# Altium project PCB_Project.PrjPcb
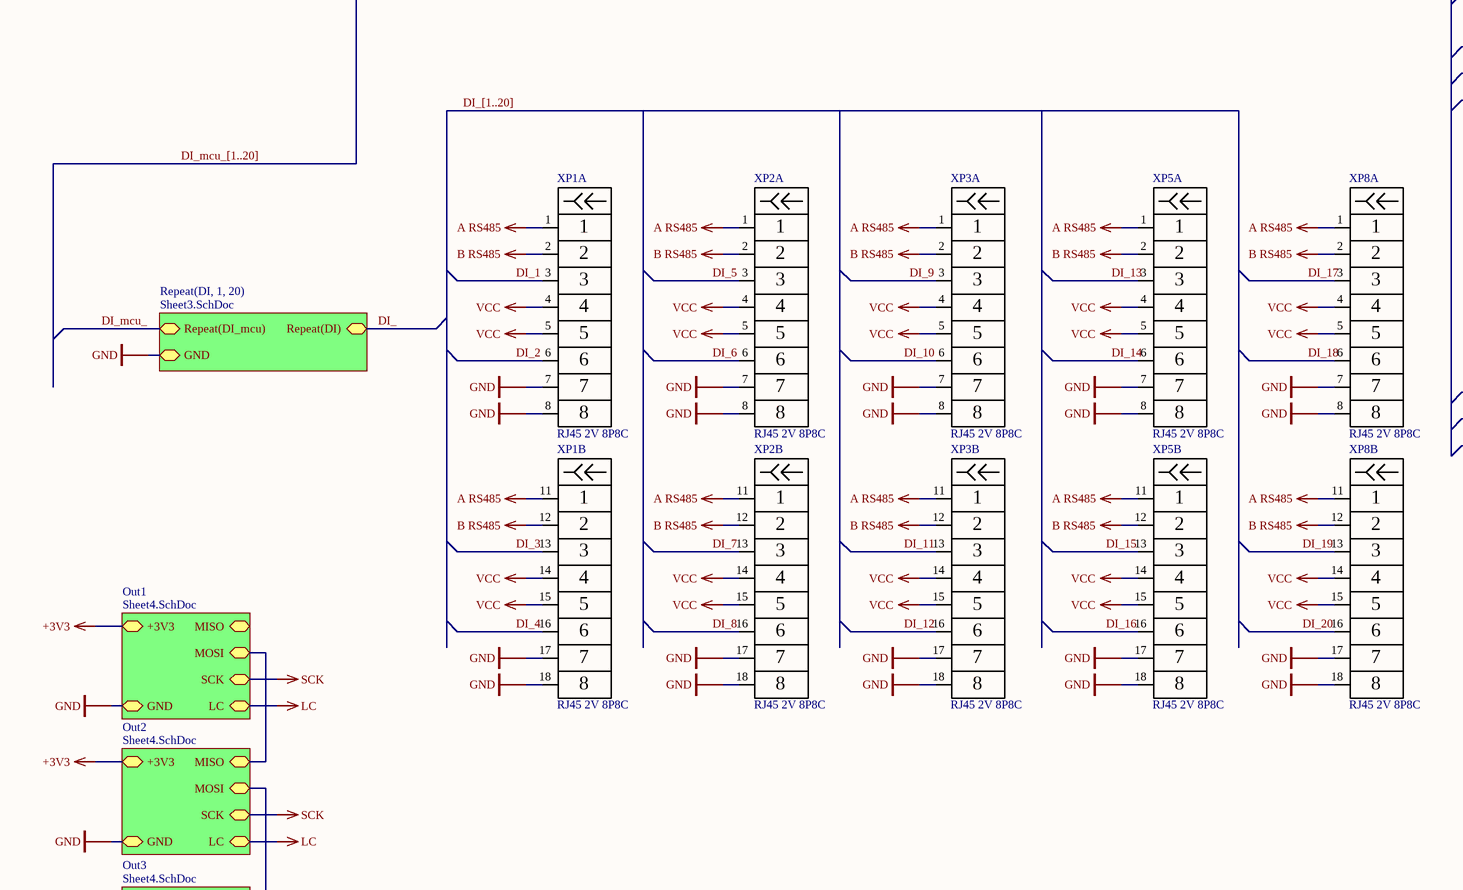
[diagram p0: Sheet1.SchDoc, top left]
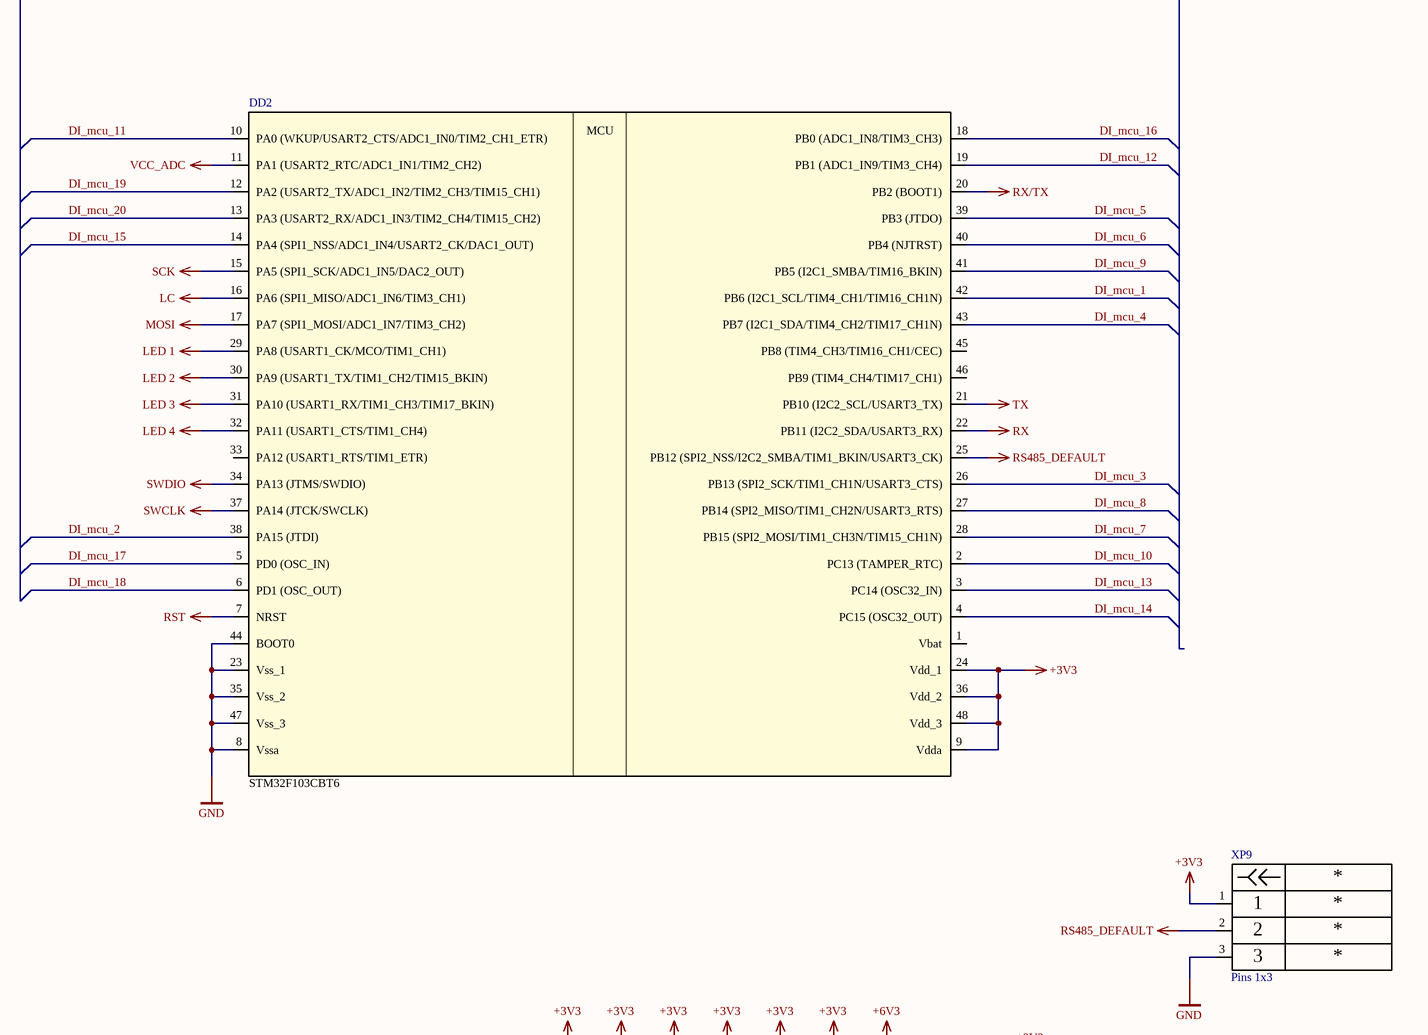
[diagram p1: Sheet1.SchDoc, top right]
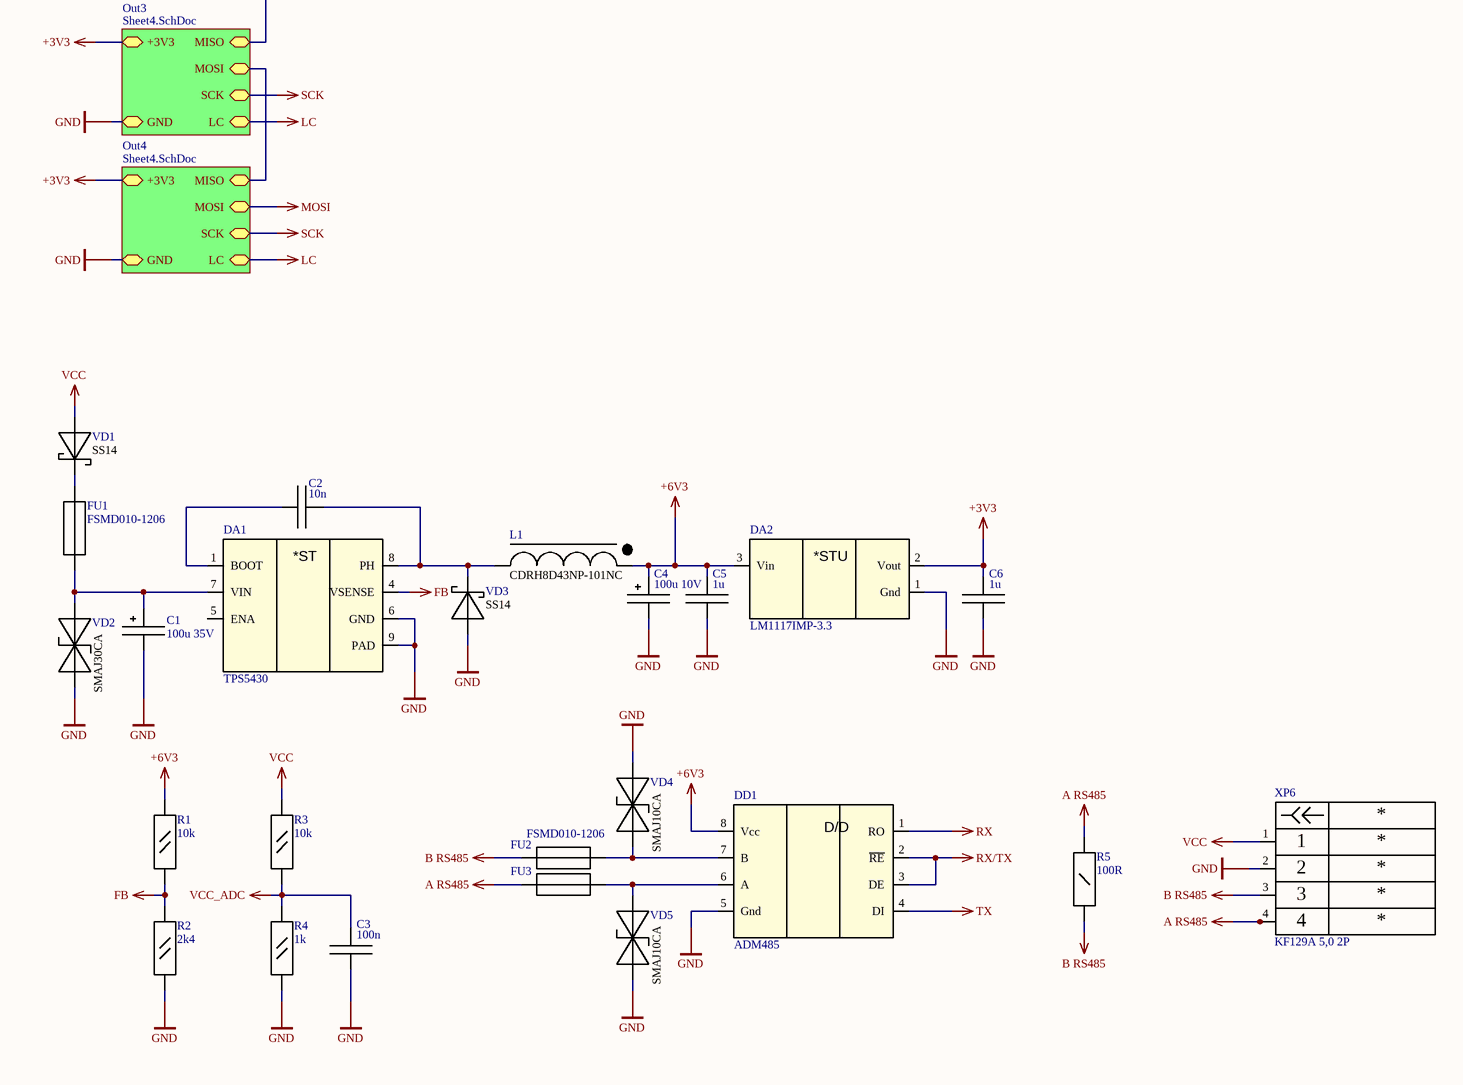
[diagram p2: Sheet1.SchDoc, bottom left]
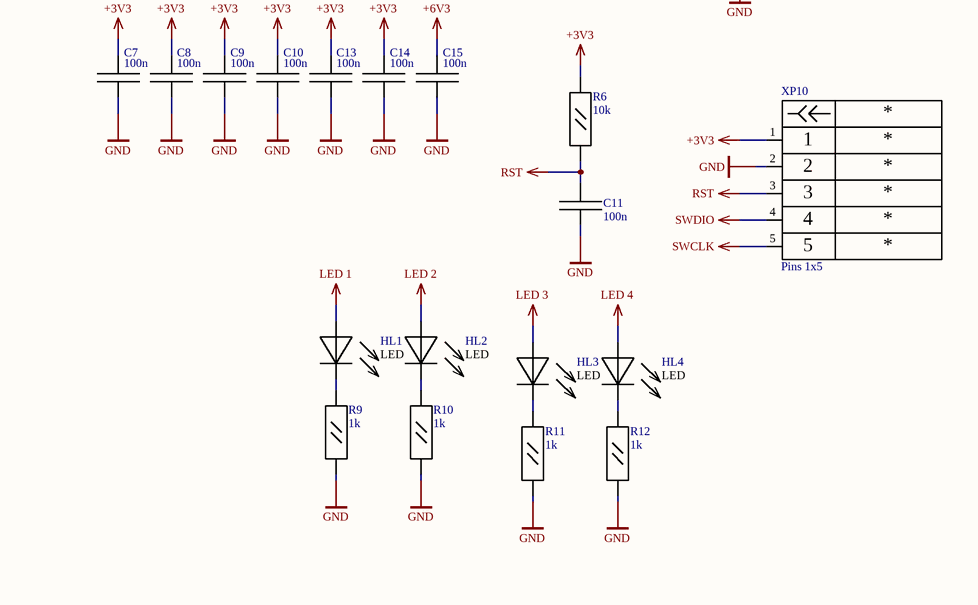
[diagram p3: Sheet1.SchDoc, bottom right]
3 sheets, 201 parts. Net scope: hierarchical (ports join the sheet entries above them; power ports are global).
Board file: PCB3.PcbDoc
Sheets:
  Sheet1.SchDoc
    Out1 = Sheet4.SchDoc
    Out2 = Sheet4.SchDoc
    Out3 = Sheet4.SchDoc
    Out4 = Sheet4.SchDoc
    DI1 = Sheet3.SchDoc
    DI2 = Sheet3.SchDoc
    DI3 = Sheet3.SchDoc
    DI4 = Sheet3.SchDoc
    DI5 = Sheet3.SchDoc
    DI6 = Sheet3.SchDoc
    DI7 = Sheet3.SchDoc
    DI8 = Sheet3.SchDoc
    DI9 = Sheet3.SchDoc
    DI10 = Sheet3.SchDoc
    DI11 = Sheet3.SchDoc
    DI12 = Sheet3.SchDoc
    DI13 = Sheet3.SchDoc
    DI14 = Sheet3.SchDoc
    DI15 = Sheet3.SchDoc
    DI16 = Sheet3.SchDoc
    DI17 = Sheet3.SchDoc
    DI18 = Sheet3.SchDoc
    DI19 = Sheet3.SchDoc
    DI20 = Sheet3.SchDoc

## Sheet Sheet1.SchDoc
size 594 x 420 mm; Razrabotal: {Разработал}; Prov: {Проверил}; Tkont: {Т. конт.}; Nkont: {Н. конт.}; Utv: {Утвердил}; Naimenovanie: {Наименование}; Oboznachenie: {Обозначение}; Shifr: {Шифр}

### Parts
C1  100u 35V  [Cap electro d6.3x2.54mm]
C2  10n  [Cap Ceramic 0805]
C3  100n  [Cap Ceramic 0805]
C4  100u 10V  [Cap electro d6.3x2.54mm]
C5  1u  [Cap Ceramic 0805]
C6  1u  [Cap Ceramic 0805]
C7  100n  [Cap Ceramic 0805]
C8  100n  [Cap Ceramic 0805]
C9  100n  [Cap Ceramic 0805]
C10  100n  [Cap Ceramic 0805]
C11  100n  [Cap Ceramic 0805]
C13  100n  [Cap Ceramic 0805]
C14  100n  [Cap Ceramic 0805]
C15  100n  [Cap Ceramic 0805]
DA1  TPS5430  [SO8 S1.27W6.00 GP]
DA2  LM1117IMP-3.3  [SOT-232]
DD1  ADM485  [SO8 S1.27W6.00]
DD2  STM32F103CBT6  [TQFP48 S0.5]
FU1  FSMD010-1206  [Fuse 1206]
FU2  FSMD010-1206  [Fuse 1206]
FU3  FSMD010-1206  [Fuse 1206]  (value not drawn)
HL1  LED  [LED 0805]
HL2  LED  [LED 0805]
HL3  LED  [LED 0805]
HL4  LED  [LED 0805]
L1  CDRH8D43NP-101NC  [CDRH8D43NP-xxxNC]
R1  10k  [Resistor 0805]
R2  2k4  [Resistor 0805]
R3  10k  [Resistor 0805]
R4  1k  [Resistor 0805]
R5  100R  [Resistor 1206]
R6  10k  [Resistor 0805]
R9  1k  [Resistor 0805]
R10  1k  [Resistor 0805]
R11  1k  [Resistor 0805]
R12  1k  [Resistor 0805]
VD1  SS14  [DO-214AC SMA]
VD2  SMAJ30CA  [DO-214AC SMA]
VD3  SS14  [DO-214AC SMA]
VD4  SMAJ10CA  [DO-214AC SMA]
VD5  SMAJ10CA  [DO-214AC SMA]
XP1  RJ45 2V 8P8C  [RJ45 2V 8P8C]  (parts A,B of 2)
XP2  RJ45 2V 8P8C  [RJ45 2V 8P8C]  (parts A,B of 2)
XP3  RJ45 2V 8P8C  [RJ45 2V 8P8C]  (parts A,B of 2)
XP5  RJ45 2V 8P8C  [RJ45 2V 8P8C]  (parts A,B of 2)
XP6  KF129A 5,0 2P  [KF129A 5,0 2P]
XP8  RJ45 2V 8P8C  [RJ45 2V 8P8C]  (parts A,B of 2)
XP9  Pins 1x3  [Pins 1x3]
XP10  Pins 1x5  [Pins 1x5]

### Sub-sheets
Out1 = Sheet4.SchDoc: +3V3, GND, LC, MISO, MOSI, SCK
Out2 = Sheet4.SchDoc: +3V3, GND, LC, MISO, MOSI, SCK
Out3 = Sheet4.SchDoc: +3V3, GND, LC, MISO, MOSI, SCK
Out4 = Sheet4.SchDoc: +3V3, GND, LC, MISO, MOSI, SCK
Repeat(DI, 1, 20) = Sheet3.SchDoc: GND, Repeat(DI), Repeat(DI_mcu)

### Nets
+3V3: C6.2 C7.2 C8.2 C9.2 C10.2 C13.2 C14.2 DA2.2(Vout) DD2.9(Vdda) DD2.24(Vdd_1) DD2.36(Vdd_2) DD2.48(Vdd_3) R6.1 XP9.1 XP10.1 ; sheet Out1/+3V3, sheet Out2/+3V3, sheet Out3/+3V3, sheet Out4/+3V3
+6V3: C4.2 C5.2 C15.2 DA2.3(Vin) DD1.8(Vcc) L1.1 R1.1
A RS485: FU3.1 R5.1 XP1.1 XP1.11 XP2.1 XP2.11 XP3.1 XP3.11 XP5.1 XP5.11 XP6.4 XP8.1 XP8.11
B RS485: FU2.1 R5.2 XP1.2 XP1.12 XP2.2 XP2.12 XP3.2 XP3.12 XP5.2 XP5.12 XP6.3 XP8.2 XP8.12
FB: DA1.4(VSENSE) R1.2 R2.1
GND: C1.1 C3.1 C4.1 C5.1 C6.1 C7.1 C8.1 C9.1 C10.1 C11.1 C13.1 C14.1 C15.1 DA1.6(GND) DA1.9(PAD) DA2.1(Gnd) DD1.5(Gnd) DD2.8(Vssa) DD2.23(Vss_1) DD2.35(Vss_2) DD2.44(BOOT0) DD2.47(Vss_3) R2.2 R4.2 R9.2 R10.2 R11.2 R12.2 VD2.1 VD3.1(A) VD4.1 VD5.1 XP1.7 XP1.8 XP1.17 XP1.18 XP2.7 XP2.8 XP2.17 XP2.18 XP3.7 XP3.8 XP3.17 XP3.18 XP5.7 XP5.8 XP5.17 XP5.18 XP6.2 XP8.7 XP8.8 XP8.17 XP8.18 XP9.3 XP10.2 ; sheet Out1/GND, sheet Out2/GND, sheet Out3/GND, sheet Out4/GND, sheet Repeat(DI, 1, 20)/GND
LC: DD2.16(PA6_(SPI1_MISO/ADC1_IN6/TIM3_CH1)) ; sheet Out1/LC, sheet Out2/LC, sheet Out3/LC, sheet Out4/LC
LED 1: DD2.29(PA8_(USART1_CK/MCO/TIM1_CH1)) HL1.1(A)
LED 2: DD2.30(PA9_(USART1_TX/TIM1_CH2/TIM15_BKIN)) HL2.1(A)
LED 3: DD2.31(PA10_(USART1_RX/TIM1_CH3/TIM17_BKIN)) HL3.1(A)
LED 4: DD2.32(PA11_(USART1_CTS/TIM1_CH4)) HL4.1(A)
MOSI: DD2.17(PA7_(SPI1_MOSI/ADC1_IN7/TIM3_CH2)) ; sheet Out4/MOSI
RS485_DEFAULT: DD2.25(PB12_(SPI2_NSS/I2C2_SMBA/TIM1_BKIN/USART3_CK)) XP9.2
RST: C11.2 DD2.7(NRST) R6.2 XP10.3
RX: DD1.1(RO) DD2.22(PB11_(I2C2_SDA/USART3_RX))
RX/TX: DD1.2(~{RE}) DD1.3(DE) DD2.20(PB2_(BOOT1))
SCK: DD2.15(PA5_(SPI1_SCK/ADC1_IN5/DAC2_OUT)) ; sheet Out1/SCK, sheet Out2/SCK, sheet Out3/SCK, sheet Out4/SCK
SWCLK: DD2.37(PA14_(JTCK/SWCLK)) XP10.5
SWDIO: DD2.34(PA13_(JTMS/SWDIO)) XP10.4
TX: DD1.4(DI) DD2.21(PB10_(I2C2_SCL/USART3_TX))
VCC: R3.1 VD1.1(A) XP1.4 XP1.5 XP1.14 XP1.15 XP2.4 XP2.5 XP2.14 XP2.15 XP3.4 XP3.5 XP3.14 XP3.15 XP5.4 XP5.5 XP5.14 XP5.15 XP6.1 XP8.4 XP8.5 XP8.14 XP8.15
VCC_ADC: C3.2 DD2.11(PA1_(USART2_RTC/ADC1_IN1/TIM2_CH2)) R3.2 R4.1
DI_: sheet Repeat(DI, 1, 20)/Repeat(DI)
DI_1: XP1.3
DI_2: XP1.6
DI_3: XP1.13
DI_4: XP1.16
DI_5: XP2.3
DI_6: XP2.6
DI_7: XP2.13
DI_8: XP2.16
DI_9: XP3.3
DI_10: XP3.6
DI_11: XP3.13
DI_12: XP3.16
DI_13: XP5.3
DI_14: XP5.6
DI_15: XP5.13
DI_16: XP5.16
DI_17: XP8.3
DI_18: XP8.6
DI_19: XP8.13
DI_20: XP8.16
DI_mcu_: sheet Repeat(DI, 1, 20)/Repeat(DI_mcu)
DI_mcu_1: DD2.42(PB6_(I2C1_SCL/TIM4_CH1/TIM16_CH1N))
DI_mcu_2: DD2.38(PA15_(JTDI))
DI_mcu_3: DD2.26(PB13_(SPI2_SCK/TIM1_CH1N/USART3_CTS))
DI_mcu_4: DD2.43(PB7_(I2C1_SDA/TIM4_CH2/TIM17_CH1N))
DI_mcu_5: DD2.39(PB3_(JTDO))
DI_mcu_6: DD2.40(PB4_(NJTRST))
DI_mcu_7: DD2.28(PB15_(SPI2_MOSI/TIM1_CH3N/TIM15_CH1N))
DI_mcu_8: DD2.27(PB14_(SPI2_MISO/TIM1_CH2N/USART3_RTS))
DI_mcu_9: DD2.41(PB5_(I2C1_SMBA/TIM16_BKIN))
DI_mcu_10: DD2.2(PC13_(TAMPER_RTC))
DI_mcu_11: DD2.10(PA0_(WKUP/USART2_CTS/ADC1_IN0/TIM2_CH1_ETR))
DI_mcu_12: DD2.19(PB1_(ADC1_IN9/TIM3_CH4))
DI_mcu_13: DD2.3(PC14_(OSC32_IN))
DI_mcu_14: DD2.4(PC15_(OSC32_OUT))
DI_mcu_15: DD2.14(PA4_(SPI1_NSS/ADC1_IN4/USART2_CK/DAC1_OUT))
DI_mcu_16: DD2.18(PB0_(ADC1_IN8/TIM3_CH3))
DI_mcu_17: DD2.5(PD0_(OSC_IN))
DI_mcu_18: DD2.6(PD1_(OSC_OUT))
DI_mcu_19: DD2.12(PA2_(USART2_TX/ADC1_IN2/TIM2_CH3/TIM15_CH1))
DI_mcu_20: DD2.13(PA3_(USART2_RX/ADC1_IN3/TIM2_CH4/TIM15_CH2))
NetC1_2: C1.2 DA1.7(VIN) FU1.2 VD2.2
NetC2_1: C2.1 DA1.1(BOOT)
NetC2_2: C2.2 DA1.8(PH) L1.2 VD3.2(K)
NetDD1_6: DD1.6(A) FU3.2 VD5.2
NetDD1_7: DD1.7(B) FU2.2 VD4.2
NetDD4_Out1_14: sheet Out1/MOSI, sheet Out2/MISO
NetDD4_Out2_14: sheet Out2/MOSI, sheet Out3/MISO
NetDD4_Out3_14: sheet Out3/MOSI, sheet Out4/MISO
NetFU1_1: FU1.1 VD1.2(K)
NetHL1_2: HL1.2(K) R9.1
NetHL2_2: HL2.2(K) R10.1
NetHL3_2: HL3.2(K) R11.1
NetHL4_2: HL4.2(K) R12.1

Not connected (* = marked no-connect by the designer): DA1 2(NC) 3(NC) 5(ENA); DD2 1(Vbat) 33(PA12_(USART1_RTS/TIM1_ETR)) 45(PB8_(TIM4_CH3/TIM16_CH1/CEC)) 46(PB9_(TIM4_CH4/TIM17_CH1))

### Buses and harness runs
bus DI_[1..20]
bus DI_mcu_[1..20]

### Notes on the sheet
- Перв. примен.
- Спра. №
- Подп. и дата
- Инв. № бубл.
- Взам. инв. №
- Инв. № подл.
- Лист
- Изм
- № докум.
- Подпись
- Дата
- Копировал
- Формат А2
- (in symbol ADM485) D/D
- (in symbol LM1117IMP-x.x) *STU
- (in symbol STM32F100C4T6) MCU
- (in symbol TPS5430) *ST

### Library data of the parts
C1 C4 = ECap: Comments: *
C2 C3 C5-C11 C13-C15 = CerCap: Comments: *
DA2 = LM1117IMP-x.x: Comments: *
DD2 = STM32F100C4T6
FU1-FU3 = FSMDxxx-1206: Comments: *
L1 = CDRH8D43NP-xxxNC
R1-R4 R6 R9-R12 = Resistor 0,125W: Comments: *
R5 = Resistor 0,25W: Comments: *
VD2 VD4 VD5 = SMAJxxCA: Comments: *
DA1 = TPS5430: Comments: *
DD1 = ADM485: Comments: *
HL1-HL4 = LED: Comments: *
VD1 VD3 = SS14: Comments: *
XP1-XP3 XP5 XP8 = RJ45 2V 8P8C: Comments: *
XP6 = KF129A 5,0 2P: Comments: *; Name1: *; Name2: *; Name3: *; Name: *; Name4: *
XP9 = Pins 1x3: Comments: *; Name1: *; Name: *; Name2: *; Name3: *
XP10 = Pins 1x5: Comments: *; Name1: *; Name: *; Name2: *; Name3: *; Name4: *; Name5: *

## Sheet Sheet4.SchDoc
size 209 x 297 mm; Razrabotal: {Разработал}; Prov: {Проверил}; Tkont: {Т. конт.}; Nkont: {Н. конт.}; Utv: {Утвердил}; Naimenovanie: {Наименование}; Oboznachenie: {Обозначение}; Shifr: {Шифр}
Used 4 times, as channels Out1, Out2, Out3, Out4. Parts and nets are listed once, with the designators drawn on the sheet.
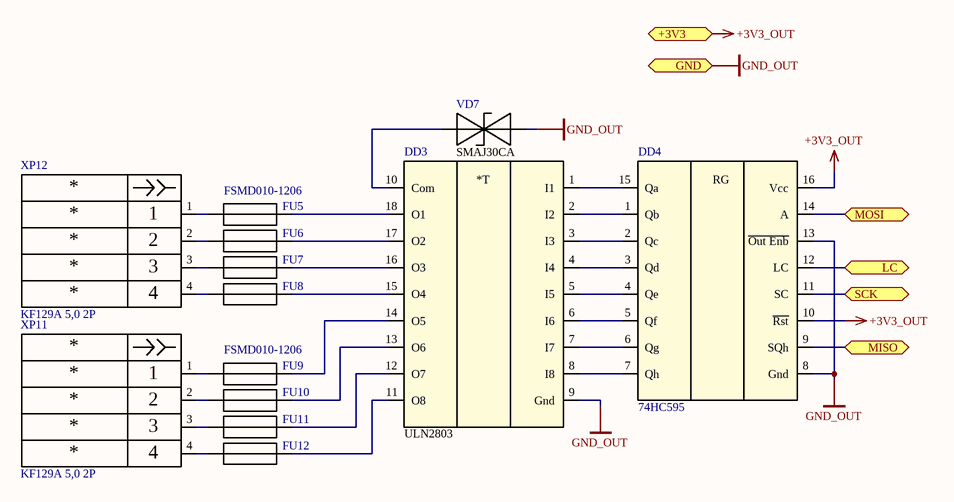
[diagram p4: Sheet4.SchDoc]

### Parts
DD3  ULN2803  [SO18 S1.27W9.9]
DD4  74НС595  [SO16 S1.27W6.00]
FU5  FSMD010-1206  [Fuse 1206]
FU6  FSMDxxx-1206  [Fuse 1206]  (value not drawn)
FU7  FSMDxxx-1206  [Fuse 1206]  (value not drawn)
FU8  FSMDxxx-1206  [Fuse 1206]  (value not drawn)
FU9  FSMD010-1206  [Fuse 1206]
FU10  FSMDxxx-1206  [Fuse 1206]  (value not drawn)
FU11  FSMDxxx-1206  [Fuse 1206]  (value not drawn)
FU12  FSMDxxx-1206  [Fuse 1206]  (value not drawn)
VD7  SMAJ30CA  [DO-214AC SMA]
XP11  KF129A 5,0 2P  [KF129A 5,0 2P]
XP12  KF129A 5,0 2P  [KF129A 5,0 2P]

### Ports
+3V3, GND, LC, MISO, MOSI, SCK

### Nets
+3V3_OUT: DD4.10(~{Rst}) DD4.16(Vcc) ; port +3V3
GND_OUT: DD3.9(Gnd) DD4.8(Gnd) DD4.13(~{Out_Enb}) VD7.1 ; port GND
LC: DD4.12(LC) ; port LC
MISO: DD4.9(SQh) ; port MISO
MOSI: DD4.14(A) ; port MOSI
SCK: DD4.11(SC) ; port SCK
NetDD3_1: DD3.1(I1) DD4.15(Qa)
NetDD3_2: DD3.2(I2) DD4.1(Qb)
NetDD3_3: DD3.3(I3) DD4.2(Qc)
NetDD3_4: DD3.4(I4) DD4.3(Qd)
NetDD3_5: DD3.5(I5) DD4.4(Qe)
NetDD3_6: DD3.6(I6) DD4.5(Qf)
NetDD3_7: DD3.7(I7) DD4.6(Qg)
NetDD3_8: DD3.8(I8) DD4.7(Qh)
NetDD3_10: DD3.10(Com) VD7.2
NetDD3_11: DD3.11(O8) FU12.2
NetDD3_12: DD3.12(O7) FU11.2
NetDD3_13: DD3.13(O6) FU10.2
NetDD3_14: DD3.14(O5) FU9.2
NetDD3_15: DD3.15(O4) FU8.2
NetDD3_16: DD3.16(O3) FU7.2
NetDD3_17: DD3.17(O2) FU6.2
NetDD3_18: DD3.18(O1) FU5.2
NetFU5_1: FU5.1 XP12.1
NetFU6_1: FU6.1 XP12.2
NetFU7_1: FU7.1 XP12.3
NetFU8_1: FU8.1 XP12.4
NetFU9_1: FU9.1 XP11.1
NetFU10_1: FU10.1 XP11.2
NetFU11_1: FU11.1 XP11.3
NetFU12_1: FU12.1 XP11.4

### Channels
Out1: designators end in _Out1; ports +3V3=+3V3 GND=GND LC=LC MISO=NetDD4_Out1_9 MOSI=NetDD4_Out1_14 SCK=SCK
Out2: designators end in _Out2; ports +3V3=+3V3 GND=GND LC=LC MISO=NetDD4_Out1_14 MOSI=NetDD4_Out2_14 SCK=SCK
Out3: designators end in _Out3; ports +3V3=+3V3 GND=GND LC=LC MISO=NetDD4_Out2_14 MOSI=NetDD4_Out3_14 SCK=SCK
Out4: designators end in _Out4; ports +3V3=+3V3 GND=GND LC=LC MISO=NetDD4_Out3_14 MOSI=MOSI SCK=SCK

### Notes on the sheet
- Перв. примен.
- Спра. №
- Подп. и дата
- Инв. № бубл.
- Взам. инв. №
- Инв. № подл.
- Лист
- Изм
- № докум.
- Подпись
- Дата
- Копировал
- Формат А4
- (in symbol 74НС595) RG
- (in symbol ULN2803) *T

### Library data of the parts
FU5 FU9 = FSMDxxx-1206: Comments: *
VD7 = SMAJxxCA: Comments: *
DD4 = 74НС595: Comments: *
FU6-FU8 FU10-FU12 = FSMDxxx-1206: Comments: *
XP11 XP12 = KF129A 5,0 2P: Comments: *; Name1: *; Name2: *; Name3: *; Name: *; Name4: *

## Sheet Sheet3.SchDoc
size 209 x 297 mm; Razrabotal: {Разработал}; Prov: {Проверил}; Tkont: {Т. конт.}; Nkont: {Н. конт.}; Utv: {Утвердил}; Naimenovanie: {Наименование}; Oboznachenie: {Обозначение}; Shifr: {Шифр}
Used 20 times, as channels DI1, DI2, DI3, DI4, DI5, DI6, DI7, DI8, DI9, DI10, DI11, DI12, DI13, DI14, DI15, DI16, DI17, DI18, DI19, DI20. Parts and nets are listed once, with the designators drawn on the sheet.
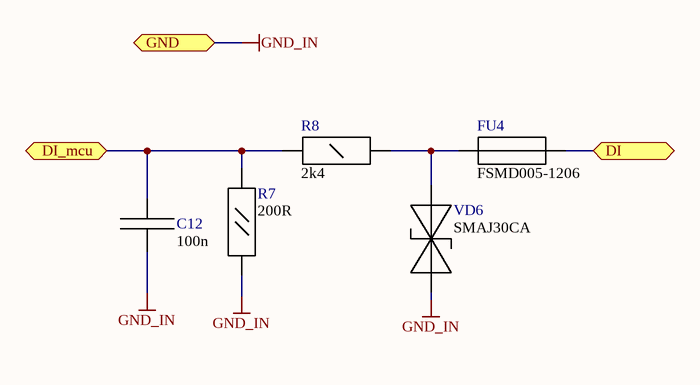
[diagram p5: Sheet3.SchDoc]

### Parts
C12  100n  [Cap Ceramic 0805]
FU4  FSMD005-1206  [Fuse 1206]
R7  200R  [Resistor 0805]
R8  2k4  [Resistor 1206]
VD6  SMAJ30CA  [DO-214AC SMA]

### Ports
DI, DI_mcu, GND

### Nets
GND_IN: C12.2 R7.1 VD6.1 ; port GND
DI: FU4.1 ; port DI
DI_mcu: C12.1 R7.2 R8.1 ; port DI_mcu
NetFU4_2: FU4.2 R8.2 VD6.2

### Channels
DI1: designators end in _DI1; ports DI=DI_1 DI_mcu=DI_mcu_1 GND=GND
DI2: designators end in _DI2; ports DI=DI_2 DI_mcu=DI_mcu_2 GND=GND
DI3: designators end in _DI3; ports DI=DI_3 DI_mcu=DI_mcu_3 GND=GND
DI4: designators end in _DI4; ports DI=DI_4 DI_mcu=DI_mcu_4 GND=GND
DI5: designators end in _DI5; ports DI=DI_5 DI_mcu=DI_mcu_5 GND=GND
DI6: designators end in _DI6; ports DI=DI_6 DI_mcu=DI_mcu_6 GND=GND
DI7: designators end in _DI7; ports DI=DI_7 DI_mcu=DI_mcu_7 GND=GND
DI8: designators end in _DI8; ports DI=DI_8 DI_mcu=DI_mcu_8 GND=GND
DI9: designators end in _DI9; ports DI=DI_9 DI_mcu=DI_mcu_9 GND=GND
DI10: designators end in _DI10; ports DI=DI_10 DI_mcu=DI_mcu_10 GND=GND
DI11: designators end in _DI11; ports DI=DI_11 DI_mcu=DI_mcu_11 GND=GND
DI12: designators end in _DI12; ports DI=DI_12 DI_mcu=DI_mcu_12 GND=GND
DI13: designators end in _DI13; ports DI=DI_13 DI_mcu=DI_mcu_13 GND=GND
DI14: designators end in _DI14; ports DI=DI_14 DI_mcu=DI_mcu_14 GND=GND
DI15: designators end in _DI15; ports DI=DI_15 DI_mcu=DI_mcu_15 GND=GND
DI16: designators end in _DI16; ports DI=DI_16 DI_mcu=DI_mcu_16 GND=GND
DI17: designators end in _DI17; ports DI=DI_17 DI_mcu=DI_mcu_17 GND=GND
DI18: designators end in _DI18; ports DI=DI_18 DI_mcu=DI_mcu_18 GND=GND
DI19: designators end in _DI19; ports DI=DI_19 DI_mcu=DI_mcu_19 GND=GND
DI20: designators end in _DI20; ports DI=DI_20 DI_mcu=DI_mcu_20 GND=GND

### Notes on the sheet
- Перв. примен.
- Спра. №
- Подп. и дата
- Инв. № бубл.
- Взам. инв. №
- Инв. № подл.
- Лист
- Изм
- № докум.
- Подпись
- Дата
- Копировал
- Формат А4

### Library data of the parts
C12 = Capacitor Nonpolar: Comments: *
FU4 = FSMDxxx-1206: Comments: *
R7 = Resistor 0,125W: Comments: *
R8 = Resistor 0,25W: Comments: *
VD6 = SMAJxxCA: Comments: *

## Nets that join several sheets
+3V3: Sheet1 (15 pins), Out1 (DD4_Out1.10 DD4_Out1.16), Out2 (DD4_Out2.10 DD4_Out2.16), Out3 (DD4_Out3.10 DD4_Out3.16), Out4 (DD4_Out4.10 DD4_Out4.16)
GND: Sheet1 (55 pins), Out1 (DD3_Out1.9 DD4_Out1.8 DD4_Out1.13 VD7_Out1.1), Out2 (DD3_Out2.9 DD4_Out2.8 DD4_Out2.13 VD7_Out2.1), Out3 (DD3_Out3.9 DD4_Out3.8 DD4_Out3.13 VD7_Out3.1), Out4 (DD3_Out4.9 DD4_Out4.8 DD4_Out4.13 VD7_Out4.1), DI1 (C12_DI1.2 R7_DI1.1 VD6_DI1.1), DI2 (C12_DI2.2 R7_DI2.1 VD6_DI2.1), DI3 (C12_DI3.2 R7_DI3.1 VD6_DI3.1), DI4 (C12_DI4.2 R7_DI4.1 VD6_DI4.1), DI5 (C12_DI5.2 R7_DI5.1 VD6_DI5.1), DI6 (C12_DI6.2 R7_DI6.1 VD6_DI6.1), DI7 (C12_DI7.2 R7_DI7.1 VD6_DI7.1), DI8 (C12_DI8.2 R7_DI8.1 VD6_DI8.1), DI9 (C12_DI9.2 R7_DI9.1 VD6_DI9.1), DI10 (C12_DI10.2 R7_DI10.1 VD6_DI10.1), DI11 (C12_DI11.2 R7_DI11.1 VD6_DI11.1), DI12 (C12_DI12.2 R7_DI12.1 VD6_DI12.1), DI13 (C12_DI13.2 R7_DI13.1 VD6_DI13.1), DI14 (C12_DI14.2 R7_DI14.1 VD6_DI14.1), DI15 (C12_DI15.2 R7_DI15.1 VD6_DI15.1), DI16 (C12_DI16.2 R7_DI16.1 VD6_DI16.1), DI17 (C12_DI17.2 R7_DI17.1 VD6_DI17.1), DI18 (C12_DI18.2 R7_DI18.1 VD6_DI18.1), DI19 (C12_DI19.2 R7_DI19.1 VD6_DI19.1), DI20 (C12_DI20.2 R7_DI20.1 VD6_DI20.1)
LC: Sheet1 (DD2.16), Out1 (DD4_Out1.12), Out2 (DD4_Out2.12), Out3 (DD4_Out3.12), Out4 (DD4_Out4.12)
MOSI: Sheet1 (DD2.17), Out4 (DD4_Out4.14)
SCK: Sheet1 (DD2.15), Out1 (DD4_Out1.11), Out2 (DD4_Out2.11), Out3 (DD4_Out3.11), Out4 (DD4_Out4.11)
DI_1: Sheet1 (XP1.3), DI1 (FU4_DI1.1)
DI_2: Sheet1 (XP1.6), DI2 (FU4_DI2.1)
DI_3: Sheet1 (XP1.13), DI3 (FU4_DI3.1)
DI_4: Sheet1 (XP1.16), DI4 (FU4_DI4.1)
DI_5: Sheet1 (XP2.3), DI5 (FU4_DI5.1)
DI_6: Sheet1 (XP2.6), DI6 (FU4_DI6.1)
DI_7: Sheet1 (XP2.13), DI7 (FU4_DI7.1)
DI_8: Sheet1 (XP2.16), DI8 (FU4_DI8.1)
DI_9: Sheet1 (XP3.3), DI9 (FU4_DI9.1)
DI_10: Sheet1 (XP3.6), DI10 (FU4_DI10.1)
DI_11: Sheet1 (XP3.13), DI11 (FU4_DI11.1)
DI_12: Sheet1 (XP3.16), DI12 (FU4_DI12.1)
DI_13: Sheet1 (XP5.3), DI13 (FU4_DI13.1)
DI_14: Sheet1 (XP5.6), DI14 (FU4_DI14.1)
DI_15: Sheet1 (XP5.13), DI15 (FU4_DI15.1)
DI_16: Sheet1 (XP5.16), DI16 (FU4_DI16.1)
DI_17: Sheet1 (XP8.3), DI17 (FU4_DI17.1)
DI_18: Sheet1 (XP8.6), DI18 (FU4_DI18.1)
DI_19: Sheet1 (XP8.13), DI19 (FU4_DI19.1)
DI_20: Sheet1 (XP8.16), DI20 (FU4_DI20.1)
DI_mcu_1: Sheet1 (DD2.42), DI1 (C12_DI1.1 R7_DI1.2 R8_DI1.1)
DI_mcu_2: Sheet1 (DD2.38), DI2 (C12_DI2.1 R7_DI2.2 R8_DI2.1)
DI_mcu_3: Sheet1 (DD2.26), DI3 (C12_DI3.1 R7_DI3.2 R8_DI3.1)
DI_mcu_4: Sheet1 (DD2.43), DI4 (C12_DI4.1 R7_DI4.2 R8_DI4.1)
DI_mcu_5: Sheet1 (DD2.39), DI5 (C12_DI5.1 R7_DI5.2 R8_DI5.1)
DI_mcu_6: Sheet1 (DD2.40), DI6 (C12_DI6.1 R7_DI6.2 R8_DI6.1)
DI_mcu_7: Sheet1 (DD2.28), DI7 (C12_DI7.1 R7_DI7.2 R8_DI7.1)
DI_mcu_8: Sheet1 (DD2.27), DI8 (C12_DI8.1 R7_DI8.2 R8_DI8.1)
DI_mcu_9: Sheet1 (DD2.41), DI9 (C12_DI9.1 R7_DI9.2 R8_DI9.1)
DI_mcu_10: Sheet1 (DD2.2), DI10 (C12_DI10.1 R7_DI10.2 R8_DI10.1)
DI_mcu_11: Sheet1 (DD2.10), DI11 (C12_DI11.1 R7_DI11.2 R8_DI11.1)
DI_mcu_12: Sheet1 (DD2.19), DI12 (C12_DI12.1 R7_DI12.2 R8_DI12.1)
DI_mcu_13: Sheet1 (DD2.3), DI13 (C12_DI13.1 R7_DI13.2 R8_DI13.1)
DI_mcu_14: Sheet1 (DD2.4), DI14 (C12_DI14.1 R7_DI14.2 R8_DI14.1)
DI_mcu_15: Sheet1 (DD2.14), DI15 (C12_DI15.1 R7_DI15.2 R8_DI15.1)
DI_mcu_16: Sheet1 (DD2.18), DI16 (C12_DI16.1 R7_DI16.2 R8_DI16.1)
DI_mcu_17: Sheet1 (DD2.5), DI17 (C12_DI17.1 R7_DI17.2 R8_DI17.1)
DI_mcu_18: Sheet1 (DD2.6), DI18 (C12_DI18.1 R7_DI18.2 R8_DI18.1)
DI_mcu_19: Sheet1 (DD2.12), DI19 (C12_DI19.1 R7_DI19.2 R8_DI19.1)
DI_mcu_20: Sheet1 (DD2.13), DI20 (C12_DI20.1 R7_DI20.2 R8_DI20.1)
NetDD4_Out1_14: Out1 (DD4_Out1.14), Out2 (DD4_Out2.9)
NetDD4_Out2_14: Out2 (DD4_Out2.14), Out3 (DD4_Out3.9)
NetDD4_Out3_14: Out3 (DD4_Out3.14), Out4 (DD4_Out4.9)